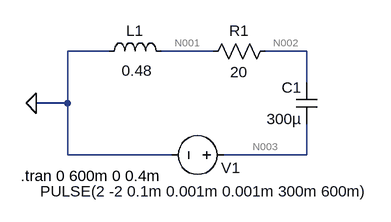
[diagram p0: schematic lab2-3.asc]
lab2-3.asc, the LTspice schematic file:
Version 4
SHEET 1 936 808
WIRE 224 80 160 80
WIRE 384 80 304 80
WIRE 528 80 464 80
WIRE 528 128 528 80
WIRE 160 160 160 80
WIRE 160 160 112 160
WIRE 160 240 160 160
WIRE 320 240 160 240
WIRE 528 240 528 192
WIRE 528 240 400 240
FLAG 112 160 0
SYMBOL res 480 64 R90
WINDOW 0 0 56 VBottom 2
WINDOW 3 32 56 VTop 2
SYMATTR InstName R1
SYMATTR Value 20
SYMBOL voltage 416 240 R90
WINDOW 123 0 0 Left 0
WINDOW 39 0 0 Left 0
WINDOW 0 20 -10 VRight 2
WINDOW 3 56 -210 VRight 2
SYMATTR InstName V1
SYMATTR Value PULSE(2 -2 0.1m 0.001m 0.001m 300m 600m)
SYMBOL ind 208 96 R270
WINDOW 0 32 56 VTop 2
WINDOW 3 2 59 VBottom 2
SYMATTR InstName L1
SYMATTR Value 0.48
SYMBOL cap 544 192 R180
WINDOW 0 24 56 Left 2
WINDOW 3 24 8 Left 2
SYMATTR InstName C1
SYMATTR Value 300µ
TEXT 88 272 Left 2 !.tran 0 600m 0 0.4m

The netlist it stands for:
* lab2-3.asc
R1 N002 N001 20
V1 N003 0 PULSE(2 -2 0.1m 0.001m 0.001m 300m 600m)
L1 0 N001 0.48
C1 N003 N002 300µ
.tran 0 600m 0 0.4m
.backanno
.end

* Results of the author's LTspice run, read from the files saved beside the schematic
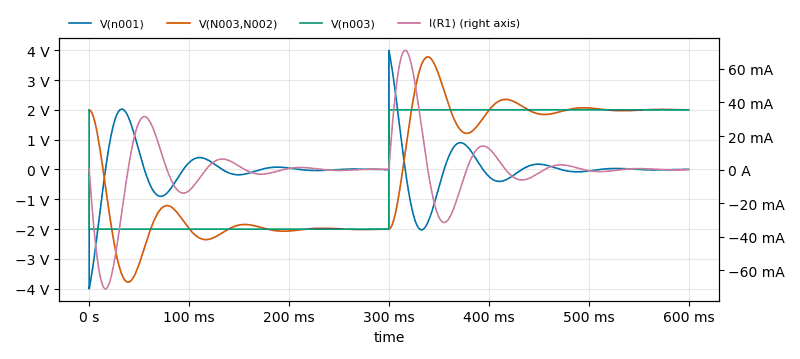
[diagram p1: Transient Analysis of lab2-3.asc, plotted from the saved traces]
* Transient Analysis, 1 run:
*   V(n001): min -4 V, max 3.994 V, average -133.7 µV, rms 799.5 mV, last 6.203 mV
*   V(N003,N002): min -3.777 V, max 3.776 V, average 161 µV, rms 2.117 V, last 1.997 V
*   V(n003): min -2 V, max 2 V, average -6.667 µV, rms 2 V, last 2 V
*   I(R1): min -71.14 mA, max 71.08 mA, average -1.7 µA, rms 19.99 mA, last -160.8 µA